# EAGLE design schematic (EAGLE 9.6.2)
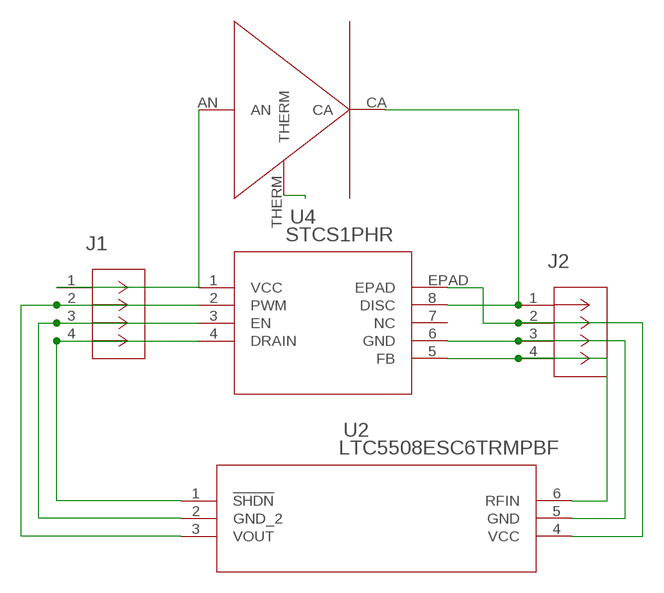
[diagram p0: schematic, sheet 1]

## Parts
J1  61300411121  [CONN_61300411121_WRE]
J2  61300411121  [CONN_61300411121_WRE]
U2  LTC5508ESC6TRMPBF  [SOT-6_SC_LIT]
U4  STCS1PHR  [POWERSO-8_STM]
U$1  MKRAWT-02-0000-0D00J2051  [MKRAWT-02-0000-0D00J2051]

## Nets
N$1: J1.1 U4.1(VCC) U$1.AN
N$2: J1.2 U2.3(VOUT) U4.2(PWM)
N$3: J1.3 U2.2(GND_2) U4.3(EN)
N$4: J1.4 U2.1(!SHDN) U4.4(DRAIN)
N$5: J2.4 U2.6(RFIN) U4.5(FB)
N$7: J2.1 U4.8(DISC) U$1.CA
N$9: J2.2 U2.4(VCC) U4.EPAD
N$12: J2.3 U2.5(GND) U4.6(GND)
THERM: U$1.THERM
Unconnected: U4.7(NC)

## Library data of the parts
J1 J2 = boat_light:61300411121; COPYRIGHT: Copyright (C) 2022 Ultra Librarian. All rights reserved.; DIGI-KEY_PART_NUMBER_1: 732-5317-ND; MANUFACTURER_PART_NUMBER: 61300411121; MFR_NAME: Wurth Electronics
U2 = boat_light:LTC5508ESC6TRMPBF; COPYRIGHT: Copyright (C) 2022 Ultra Librarian. All rights reserved.; DIGI-KEY_PART_NUMBER_1: LTC5508ESC6#TRMPBFCT-ND; DIGI-KEY_PART_NUMBER_2: LTC5508ESC6#TRMPBFDKR-ND; DIGI-KEY_PART_NUMBER_3: LTC5508ESC6#TRMPBFTR-ND; MANUFACTURER_PART_NUMBER: LTC5508ESC6#TRMPBF; MFR_NAME: Analog Devices / Linear Technology
U4 = boat_light:STCS1PHR; COPYRIGHT: Copyright (C) 2022 Ultra Librarian. All rights reserved.; DIGI-KEY_PART_NUMBER_1: 497-5961-2-ND; DIGI-KEY_PART_NUMBER_2: 497-5961-1-ND; DIGI-KEY_PART_NUMBER_3: 497-5961-6-ND; DIGI-KEY_PART_NUMBER_4: 1026-STCS1PHR-CHP; MANUFACTURER_PART_NUMBER: STCS1PHR; MFR_NAME: STMicroelectronics
U$1 = boat_light:MKRAWT-02-0000-0D00J2051

## Board
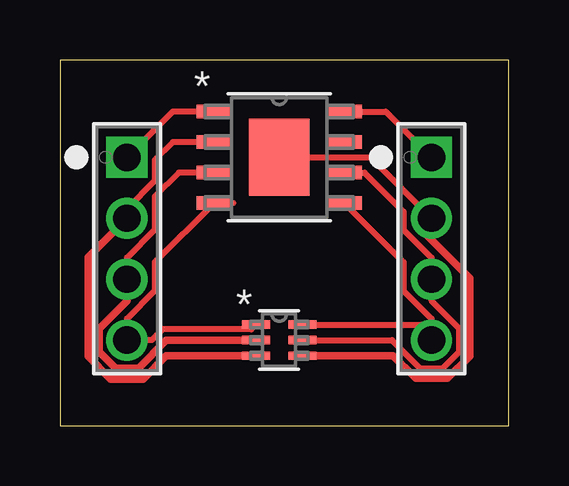
[diagram p1: board, top side]
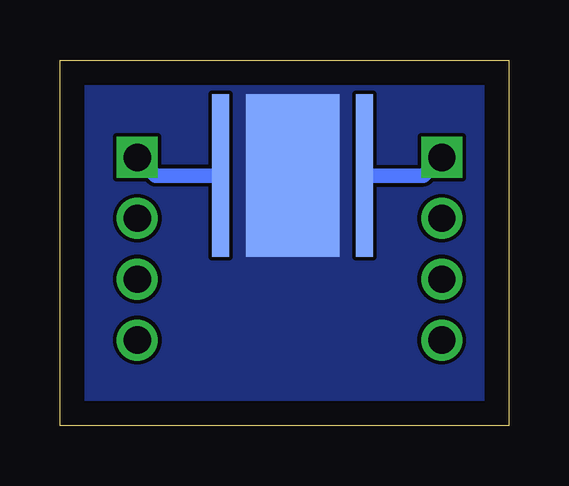
[diagram p2: board, bottom side, seen from below]

Size 18.72 x 15.23 mm. Coordinates in mm from the lower left corner, seen from the top.
Outline: 0,0 18.72,0 18.72,15.23 0,15.23 0,0
Copper layers (1*16): Top 0.035mm / dielectric 1.5mm / Bottom 0.035mm
Design rules "default": minimum track width 6mil, minimum drill 0.35mm, track to track 6mil, track to pad 6mil, pad to pad 6mil, via to via 6mil, smd to smd 6mil, copper to edge 40mil, drill to drill 6mil, minimum pad ring 10mil, minimum via ring 8mil, stop-mask expansion 4mil, vias tented up to drill 0mil, thermal gap 10mil

### Footprints (pad centres in the part's own frame; a part is rotated, then mirrored left to right if it is on the bottom)
CONN_61300411121_WRE = drill 1.143 pad 1.651 square: 1 0,0 | drill 1.143 pad 1.651: 2 2.54,0; 3 5.08,0; 4 7.62,0
SOT-6_SC_LIT = smd 1.171 x 0.351: 1 -0.97,0.65; 2 -0.97,0; 3 -0.97,-0.65; 4 0.97,-0.65; 5 0.97,0; 6 0.97,0.65
POWERSO-8_STM = smd 1.46 x 0.559: 1 -2.724,1.905; 2 -2.724,0.635; 3 -2.724,-0.635; 4 -2.724,-1.905; 5 2.724,-1.905; 6 2.724,-0.635; 7 2.724,0.635; 8 2.724,1.905 | smd 2.515 x 3.2: EPAD 0,0
MKRAWT-02-0000-0D00J2051 = smd 0.7 x 6.76: AN -3,0; CA 3,0 | smd 3.9 x 6.76: THERM 0,0

### Placement (x,y rotation side)
J1  2.79,11.18 270 top
J2  15.49,11.18 270 top
U2  9.14,3.56 0 top
U4  9.14,11.18 0 top
U$1  9.02,10.41 180 bottom

### Tracks (layer width: path | path; a pad name or v marks a point on that pad's centre or on a via)
N$1
  Top 0.254: U4.1 4.7,13.08 J1.1
  Bottom 0.61: U$1.AN 3.56,10.41 J1.1
N$2
  Top 0.254: U4.2 4.7,11.81 3.96,11.07 3.96,10.19 2.79,9.03 J1.2
  Top 0.305: U2.3 4.43,2.91 3.46,1.94 2.12,1.94 1.18,2.88 1.18,7.02 J1.2
N$3
  Top 0.254: U4.3 4.95,10.54 3.96,9.55 3.96,8.15 2.79,6.99 2.79,6.48 J1.3
  Top 0.305: 2.79,6.48 2.79,5.2 1.63,4.04 1.63,3.08 2.31,2.39 3.27,2.39 4.44,3.56 U2.2
N$4
  Top 0.254: 7.24,9.27 U4.4 3.96,6.81 3.96,5.62 2.79,4.45 J1.4 3.83,3.56 4.28,4.01 7.98,4.01 U2.1
N$5
  Top 0.254: U4.5 14.33,6.81 14.33,5.62 15.49,4.45 15.49,3.81 | 15.49,3.81 J2.4 | U2.6 15.1,4.21 15.49,3.81
N$7
  Top 0.254: U4.8 13.59,13.08 J2.1
  Bottom 0.61: U$1.CA 14.73,10.41 J2.1
N$9
  Top 0.254: U4.EPAD 12.95,11.18 15.3,8.83 J2.2
  Top 0.305: 15.3,8.83 15.3,7.93 17.09,6.15 17.09,2.9 16.15,1.96 14.83,1.96 13.89,2.91 U2.4
N$12
  Top 0.254: U4.6 12.7,10.54 14.33,8.91 14.33,8.15 15.49,6.99 J2.3 15.49,5.2 16.66,4.04 16.66,3.08 15.97,2.39 15.01,2.39 13.85,3.56 U2.5
THERM
  pour Bottom (no thermals): 0,15.24 19.05,15.24 19.05,0 0,0